# EAGLE schematic midi-to-cv (EAGLE 9.5.2)
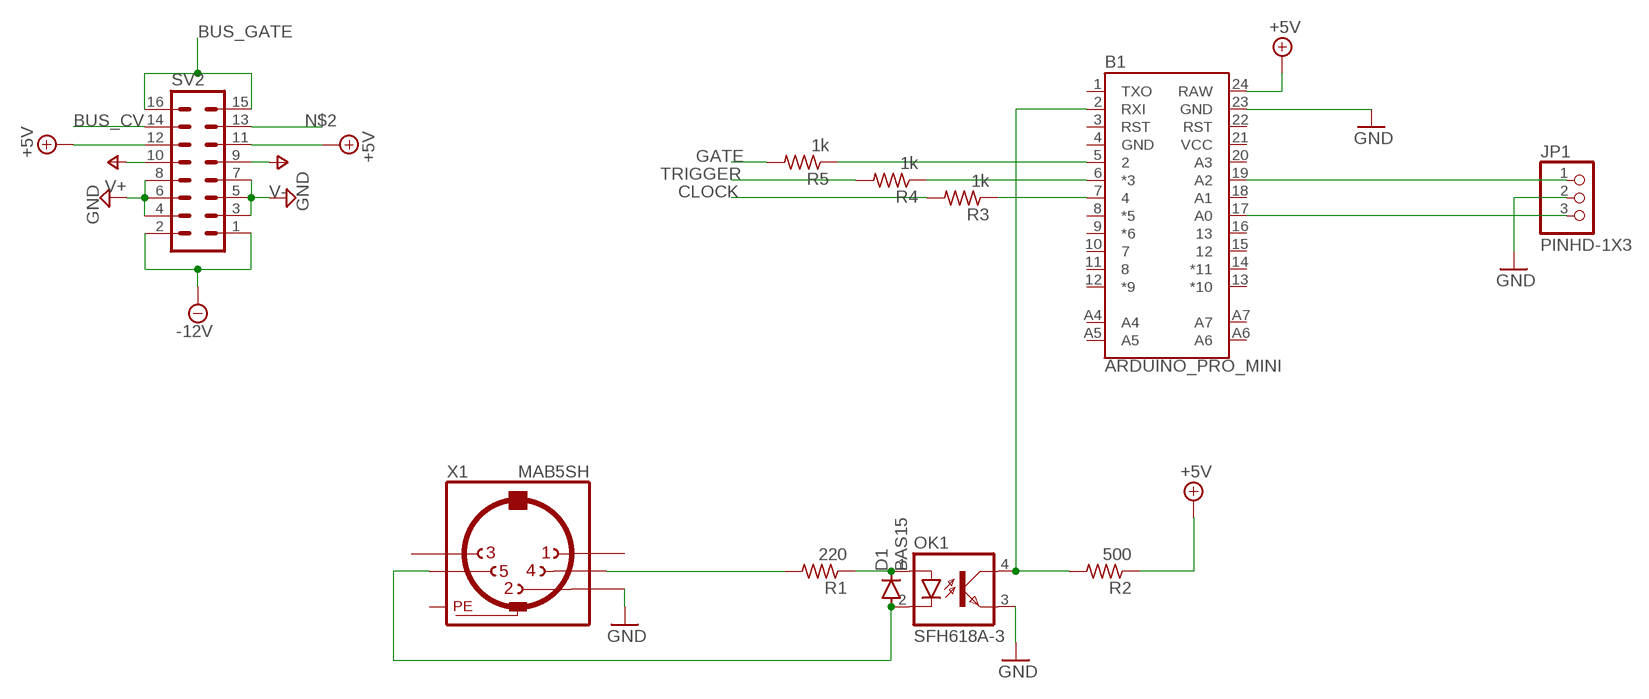
[diagram p0: schematic, sheet 1]

## Parts
B1  ARDUINO_PRO_MINI  [ARDUINO_PRO_MINI]
D1  BAS15  [DO34-7]
JP1  PINHD-1X3  [1X03]
OK1  SFH618A-3  [DIP4]
R1  220  R-US_0204/5  [0204/5]
R2  500  R-US_0204/5  [0204/5]
R3  1k  R-US_0204/5  [0204/5]
R4  1k  R-US_0204/5  [0204/5]
R5  1k  R-US_0204/5  [0204/5]
SV2  MA08-2  [MA08-2]
X1  MAB5SH  [MAB5SH]

## Nets
+5V: B1.24(RAW) R2.1 SV2.12
-12V: SV2.1 SV2.2
BUS_CV: SV2.14
BUS_GATE: SV2.15 SV2.16
CLOCK: R3.2
GATE: R5.2
GND: B1.23(GND) JP1.2 OK1.3(EMIT) SV2.3 SV2.4 SV2.5 SV2.6 SV2.7 SV2.8 X1.2
N$1: SV2.11 ; supply symbol labelled +5V
N$2: SV2.13
N$3: D1.A OK1.2(C) X1.5
N$4: D1.C OK1.1(A) R1.1
N$5: R1.2 X1.4
N$6: B1.2(RXI) OK1.4(COL) R2.2
N$7: B1.7 R3.1
N$8: B1.6(*3) R4.1
N$9: B1.5 R5.1
N$10: B1.17(A0) JP1.3
N$11: B1.19(A2) JP1.1
TRIGGER: R4.2
V+: SV2.10
V-: SV2.9
Unconnected: B1.1(TXO) B1.3(RST) B1.8(*5) B1.9(*6) B1.10 B1.11 B1.12(*9) B1.13(*10) B1.14(*11) B1.15 B1.16 B1.18(A1) B1.20(A3) B1.22(RST) B1.A4 B1.A5 B1.A6 B1.A7 X1.1 X1.3

## Power pins joined to a net without a drawn wire
GND: B1.4(GND)
PE: X1.PE X1.PE@(PE)
VCC: B1.21(VCC)

## Library data of the parts
B1 = SparkFun-Boards:ARDUINO_PRO_MINI: SparkFun Pro Mini Pro Mini compatible footprint. Dimensions: 0.7 x 1.3" PCB Thickness: 0.8mm SparkFun Products: 3.3V/8MHz <https://www.sparkfun.com/products/11114> 5V/16MHz <https://www.sparkfun.com/products/11113>
D1 = diode:BAS15: DIODE high speed
JP1 = Connector:PINHD-1X3: PIN HEADER; CATEGORY: CONNECTOR; SUB-CATEGORY: PIN-HEADER
OK1 = optocoupler:SFH618?*: Optocoupler, Phototransistor Output, Low Input Current Source: Data sheet <http://www.vishay.com/docs/83673/sfh618.pdf>; MF: VISHAY/TELEFUNKEN; MPN: SFH618A-3; OC_FARNELL: 1020374; OC_NEWARK: 58K2209
R1-R5 = rcl:R-US_: RESISTOR, American symbol; SPICEPREFIX: R
SV2 = con-lstb:MA08-2: PIN HEADER; OC_FARNELL: unknown; OC_NEWARK: unknown
X1 = con-hirschmann:MAB5SH: Female CONNECTOR 5 pins 90 deg. with shield, horizontal (DIN 41524); OC_FARNELL: 809883; OC_NEWARK: unknown